# Altium schematic sheet Processor.SchDoc
size B
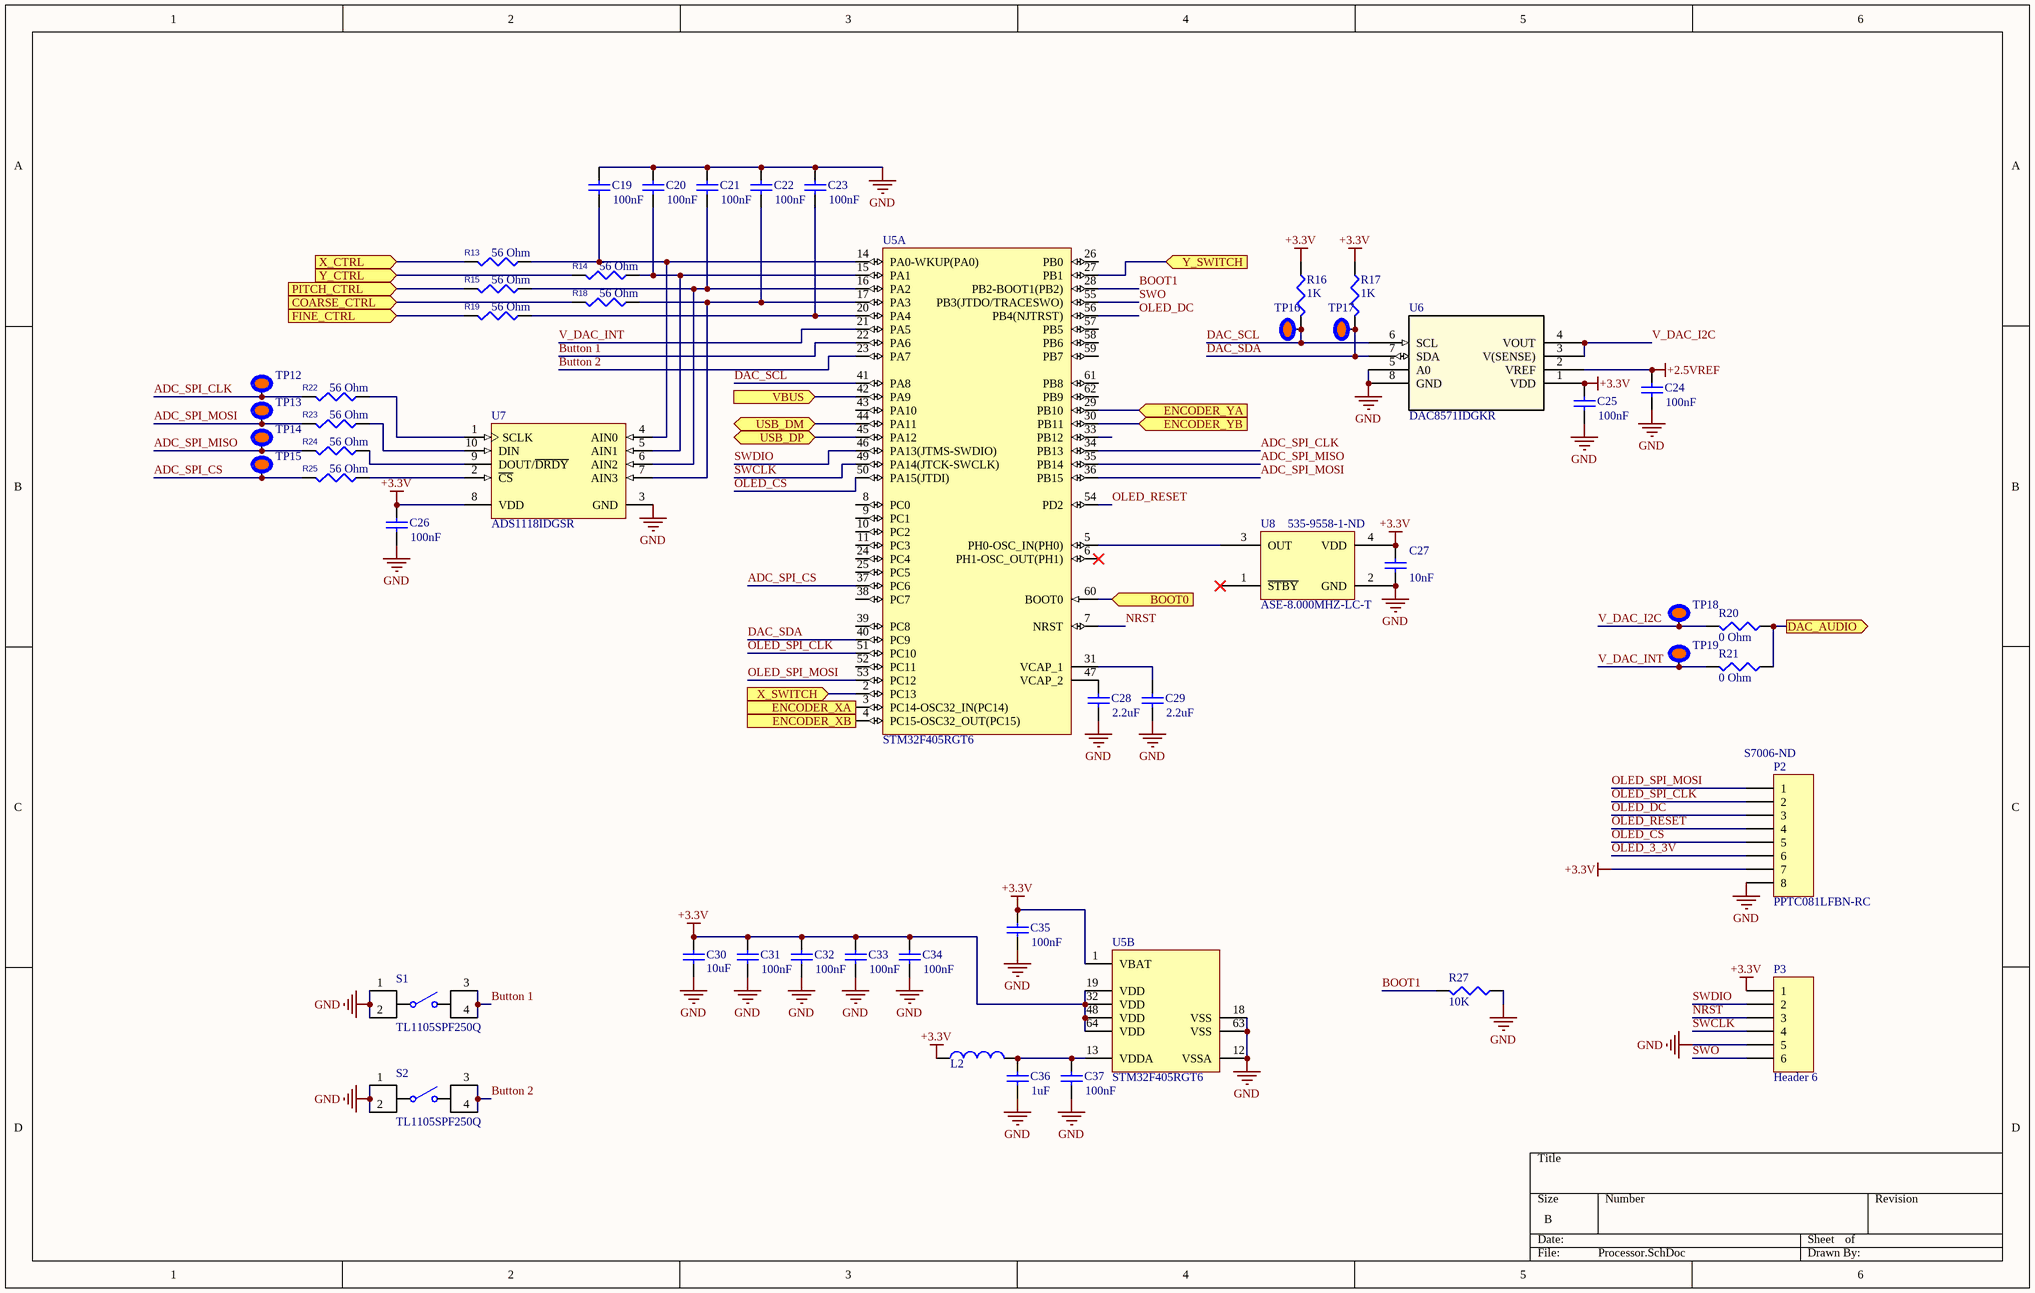
[diagram p0: Processor.SchDoc]

## Parts
C19  value 100nF  [RES_0603]  (hidden comment: 06035G104ZAT2A)
C20  value 100nF  [RES_0603]  (hidden comment: 06035G104ZAT2A)
C21  value 100nF  [RES_0603]  (hidden comment: 06035G104ZAT2A)
C22  value 100nF  [RES_0603]  (hidden comment: 06035G104ZAT2A)
C23  value 100nF  [RES_0603]  (hidden comment: 06035G104ZAT2A)
C24  value 100nF  [RES_0603]  (hidden comment: 06035G104ZAT2A)
C25  value 100nF  [RES_0603]  (hidden comment: 06035G104ZAT2A)
C26  value 100nF  [RES_0603]  (hidden comment: 06035G104ZAT2A)
C27  value 10nF  [RES_0603]  (hidden comment: CL10B103KB8NCNC)
C28  value 2.2uF  [RES_0805]  (hidden comment: C2012JB1E225M125AC)
C29  value 2.2uF  [RES_0805]  (hidden comment: C2012JB1E225M125AC)
C30  value 10uF  [RES_1206]  (hidden comment: GRT31CR61H106ME01L)
C31  value 100nF  [RES_0603]  (hidden comment: 06035G104ZAT2A)
C32  value 100nF  [RES_0603]  (hidden comment: 06035G104ZAT2A)
C33  value 100nF  [RES_0603]  (hidden comment: 06035G104ZAT2A)
C34  value 100nF  [RES_0603]  (hidden comment: 06035G104ZAT2A)
C35  value 100nF  [RES_0603]  (hidden comment: 06035G104ZAT2A)
C36  value 1uF  [RES_0603]  (hidden comment: CL10A105KA8NNNC)
C37  value 100nF  [RES_0603]  (hidden comment: 06035G104ZAT2A)
L2  742792651  [RES_0603]  (value not drawn)
P2  PPTC081LFBN-RC  Supplier Part Number 1: S7006-ND  [HDR1X8]
P3  Header 6  [TC2030-MCP]
R13  value 56 Ohm  [RES_0603]  (hidden comment: CRGP0603F56R)
R14  value 56 Ohm  [RES_0603]  (hidden comment: CRGP0603F56R)
R15  value 56 Ohm  [RES_0603]  (hidden comment: CRGP0603F56R)
R16  value 1K  [RES_0603]  (hidden comment: RR0816P-102-D)
R17  value 1K  [RES_0603]  (hidden comment: RR0816P-102-D)
R18  value 56 Ohm  [RES_0603]  (hidden comment: CRGP0603F56R)
R19  value 56 Ohm  [RES_0603]  (hidden comment: CRGP0603F56R)
R20  value 0 Ohm  [RES_0603]  (hidden comment: RC0603JR-070RL)
R21  value 0 Ohm  [RES_0603]  (hidden comment: RC0603JR-070RL)
R22  value 56 Ohm  [RES_0603]  (hidden comment: CRGP0603F56R)
R23  value 56 Ohm  [RES_0603]  (hidden comment: CRGP0603F56R)
R24  value 56 Ohm  [RES_0603]  (hidden comment: CRGP0603F56R)
R25  value 56 Ohm  [RES_0603]  (hidden comment: CRGP0603F56R)
R27  value 10K  [RES_0805]  (hidden comment: RR1220P-103-D)
S1  TL1105SPF250Q  [E_SWITCH]
S2  TL1105SPF250Q  [E_SWITCH]
TP12  loop test point  [Test Point Mt Hole]  (value not drawn)
TP13  loop test point  [Test Point Mt Hole]  (value not drawn)
TP14  loop test point  [Test Point Mt Hole]  (value not drawn)
TP15  loop test point  [Test Point Mt Hole]  (value not drawn)
TP16  loop test point  [Test Point Mt Hole]  (value not drawn)
TP17  loop test point  [Test Point Mt Hole]  (value not drawn)
TP18  loop test point  [Test Point Mt Hole]  (value not drawn)
TP19  loop test point  [Test Point Mt Hole]  (value not drawn)
U5  STM32F405RGT6  [STM-LQFP64_N]  (parts A,B of 2)
U6  DAC8571IDGKR  [DGK8]
U7  ADS1118IDGSR  [TI-DGS10_N]
U8  ASE-8.000MHZ-LC-T  Supplier Part Number 1: 535-9558-1-ND  [ASE-8.000MHZ-LC-T]

## Ports
BOOT0 (in), COARSE_CTRL (in), DAC_AUDIO (out), ENCODER_XA (in), ENCODER_XB (in), ENCODER_YA (in), ENCODER_YB (in), FINE_CTRL (in), PITCH_CTRL (in), USB_DM (bidir), USB_DP (bidir), VBUS (in), X_CTRL (in), X_SWITCH (in), Y_CTRL (in), Y_SWITCH (in)

## Nets
+2.5VREF: C24.2 U6.2(VREF)
+3.3V: C25.2 C26.2 C27.2 C30.1 C31.2 C32.2 C33.2 C34.2 C35.2 L2.1 P2.7 P3.1 R16.1 R17.1 U5.1(VBAT) U5.19(VDD) U5.32(VDD) U5.48(VDD) U5.64(VDD) U6.1(VDD) U7.8(VDD) U8.4(VDD)
GND: C19.2 C20.2 C21.2 C22.2 C23.2 C24.1 C25.1 C26.1 C27.1 C28.1 C29.1 C30.2 C31.1 C32.1 C33.1 C34.1 C35.1 C36.1 C37.1 P2.8 P3.5 R27.1 S1.1(COMMON) S1.2(COMMON) S2.1(COMMON) S2.2(COMMON) U5.12(VSSA) U5.18(VSS) U5.63(VSS) U6.5(A0) U6.8(GND) U7.3(GND) U8.2(GND)
ADC_SPI_CLK: R22.2 TP12.1 U5.34(PB13)
ADC_SPI_CS: R25.2 TP15.1 U5.37(PC6)
ADC_SPI_MISO: R24.2 TP14.1 U5.35(PB14)
ADC_SPI_MOSI: R23.2 TP13.1 U5.36(PB15)
BOOT0: U5.60(BOOT0) ; port BOOT0
BOOT1: R27.2 U5.28(PB2-BOOT1(PB2))
Button 1: S1.3(NO) S1.4(NO) U5.22(PA6)
Button 2: S2.3(NO) S2.4(NO) U5.23(PA7)
COARSE_CTRL: R18.2 ; port COARSE_CTRL
DAC_AUDIO: R20.1 R21.1 ; port DAC_AUDIO
DAC_SCL: R16.2 TP16.1 U5.41(PA8) U6.6(SCL)
DAC_SDA: R17.2 TP17.1 U5.40(PC9) U6.7(SDA)
ENCODER_XA: U5.3(PC14-OSC32_IN(PC14)) ; port ENCODER_XA
ENCODER_XB: U5.4(PC15-OSC32_OUT(PC15)) ; port ENCODER_XB
ENCODER_YA: U5.29(PB10) ; port ENCODER_YA
ENCODER_YB: U5.30(PB11) ; port ENCODER_YB
FINE_CTRL: R19.2 ; port FINE_CTRL
NRST: P3.3 U5.7(NRST)
OLED_3_3V: P2.6
OLED_CS: P2.5 U5.50(PA15(JTDI))
OLED_DC: P2.3 U5.56(PB4(NJTRST))
OLED_RESET: P2.4 U5.54(PD2)
OLED_SPI_CLK: P2.2 U5.51(PC10)
OLED_SPI_MOSI: P2.1 U5.53(PC12)
PITCH_CTRL: R15.2 ; port PITCH_CTRL
SWCLK: P3.4 U5.49(PA14(JTCK-SWCLK))
SWDIO: P3.2 U5.46(PA13(JTMS-SWDIO))
SWO: P3.6 U5.55(PB3(JTDO/TRACESWO))
USB_DM: U5.44(PA11) ; port USB_DM
USB_DP: U5.45(PA12) ; port USB_DP
V_DAC_I2C: R20.2 TP18.1 U6.3(V(SENSE)) U6.4(VOUT)
V_DAC_INT: R21.2 TP19.1 U5.21(PA5)
VBUS: U5.42(PA9) ; port VBUS
X_CTRL: R13.2 ; port X_CTRL
X_SWITCH: U5.2(PC13) ; port X_SWITCH
Y_CTRL: R14.2 ; port Y_CTRL
Y_SWITCH: U5.27(PB1) ; port Y_SWITCH
NetC19_1: C19.1 R13.1 U5.14(PA0-WKUP(PA0)) U7.4(AIN0)
NetC20_1: C20.1 R14.1 U5.15(PA1) U7.5(AIN1)
NetC21_1: C21.1 R15.1 U5.16(PA2) U7.6(AIN2)
NetC22_1: C22.1 R18.1 U5.17(PA3) U7.7(AIN3)
NetC23_1: C23.1 R19.1 U5.20(PA4)
NetC28_2: C28.2 U5.47(VCAP_2)
NetC29_2: C29.2 U5.31(VCAP_1)
NetC36_2: C36.2 C37.2 L2.2 U5.13(VDDA)
NetR22_1: R22.1 U7.1(SCLK)
NetR23_1: R23.1 U7.10(DIN)
NetR24_1: R24.1 U7.9(DOUT/~{DRDY})
NetR25_1: R25.1 U7.2(~{CS})
NetU5_5: U5.5(PH0-OSC_IN(PH0)) U8.3(OUT)

Not connected (* = marked no-connect by the designer): U5 6(PH1-OSC_OUT(PH1))* 8(PC0) 9(PC1) 10(PC2) 11(PC3) 24(PC4) 25(PC5) 26(PB0) 33(PB12) 38(PC7) 39(PC8) 43(PA10) 52(PC11) 57(PB5) 58(PB6) 59(PB7) 61(PB8) 62(PB9); U8 1(~{STBY})*

## Library data of the parts
C19-C26 C31-C35 C37 = Cap: Capacitor; Manufacturer: AVX Corporation; Manufacturer Part Number: 06035G104ZAT2A; Supplier 1: Digi-Key; Supplier Part Number 1: 478-3724-1-ND
C27 C36 = Cap: Capacitor; Manufacturer: Samsung Electro-Mechanics; Supplier 1: Digi-Key
  C27: Manufacturer Part Number: CL10B103KB8NCNC; Supplier Part Number 1: 1276-1921-1-ND
  C36: Manufacturer Part Number: CL10A105KA8NNNC; Supplier Part Number 1: 1276-1102-1-ND
C28 C29 = Cap: Capacitor; Manufacturer: TDK; Manufacturer Part Number: C2012JB1E225M125AC; Supplier 1: Mouser; Supplier Part Number 1: 810-C2012JB1E225M12C
C30 = Cap: Capacitor; Manufacturer: Murata; Supplier 1: Digi-Key; Supplier Part Number 1: 490-12457-1-ND; Manufacturer Part Number: GRT31CR61H106ME01L
L2 = Inductor: Manufacturer: Wurth Electronics Inc.; Value: 600 OHM; Manufacturer Part Number: 742792651; Supplier 1: Digi-Key; Supplier Part Number 1: 732-1593-2-ND
P2 = MHDR1X8: Header, 8-Pin; Manufacturer: Sullins Connector Solutions; Supplier 1: Digi-Key; Manufacturer Part Number: PPTC081LFBN-RC
P3 = Header 6: Header, 6-Pin; LatestRevisionDate: 17-Jul-2002; LatestRevisionNote: Re-released for DXP Platform.; Publisher: Altium Limited
R13-R15 R18 R19 R22-R25 = R_Dup1: Resistor; Manufacturer: TE Connectivity Passive Product; Manufacturer Part Number: CRGP0603F56R; Supplier 1: Digi-Key; Supplier Part Number 1: A130401CT-ND
R16 R17 R27 = Res3: Resistor; Manufacturer: Susumu; Supplier 1: Digi-Key
  R16 R17: Manufacturer Part Number: RR0816P-102-D; Supplier Part Number 1: RR08P1.0KDDKR-ND
  R27: Manufacturer Part Number: RR1220P-103-D; Supplier Part Number 1: RR12P10.0KDCT-ND
R20 R21 = Res3: Resistor; Manufacturer: Yageo; Manufacturer Part Number: RC0603JR-070RL; Supplier 1: Digi-Key; Supplier Part Number 1: 311-0.0GRCT-ND
S1 S2 = SPST E SWITCH: SWITCH TACTILE SPST; Manufacturer: E-Switch; Supplier 1: Digi-Key; Supplier Part Number 1: EG1862-ND; Manufacturer Part Number: TL1105SPF250Q
TP12-TP19 = 402046: Test Point Loop Miniature Keysone; Manufacturer: Keystone Electronics; Manufacturer Part Number: 5003; Supplier 1: Digi-Key; Supplier Part Number 1: 36-5003-ND
U5 = STM32F405RGT6: ARM Cortex-M4 32-bit MCU+FPU, 210 DMIPS, 1024 kB Flash, 192 kB Internal RAM, 51 I/Os, 64-pin LQFP, -40 to 85 degC, Tray; Manufacturer: STMicroelectronics; Supplier 1: Digi-Key; Supplier Part Number 1: 497-11767-ND; Manufacturer Part Number: STM32F405RGT6
U6 = DAC8571IDGKR: Manufacturer: Texas Instruments; Manufacturer Part Number: DAC8571IDGKR; Supplier 1: Digi-Key; Supplier Part Number 1: 296-14307-1-ND
U7 = ADS1118IDGSR: 16-Bit ADC with Integrated Multiplexer, PGA, Temperature Sensor, Oscillator, and Reference, -40 to 125 degC, 10-pin SOP (DGS10), Green (RoHS & no Sb/Br); Manufacturer: Texas Instruments; Manufacturer Part Number: ADS1118IDGSR; Supplier 1: Digi-Key; Supplier Part Number 1: 296-38850-1-ND
U8 = ASE-8.000MHZ-LC-T: XTAL OSC XO 8.0000MHZ CMOS SMD; Manufacturer: Abracon LLC; Manufacturer Part Number: ASE-8.000MHZ-LC-T; Supplier 1: Digi-Key